# Altium schematic sheet schematic.SchDoc
size A4
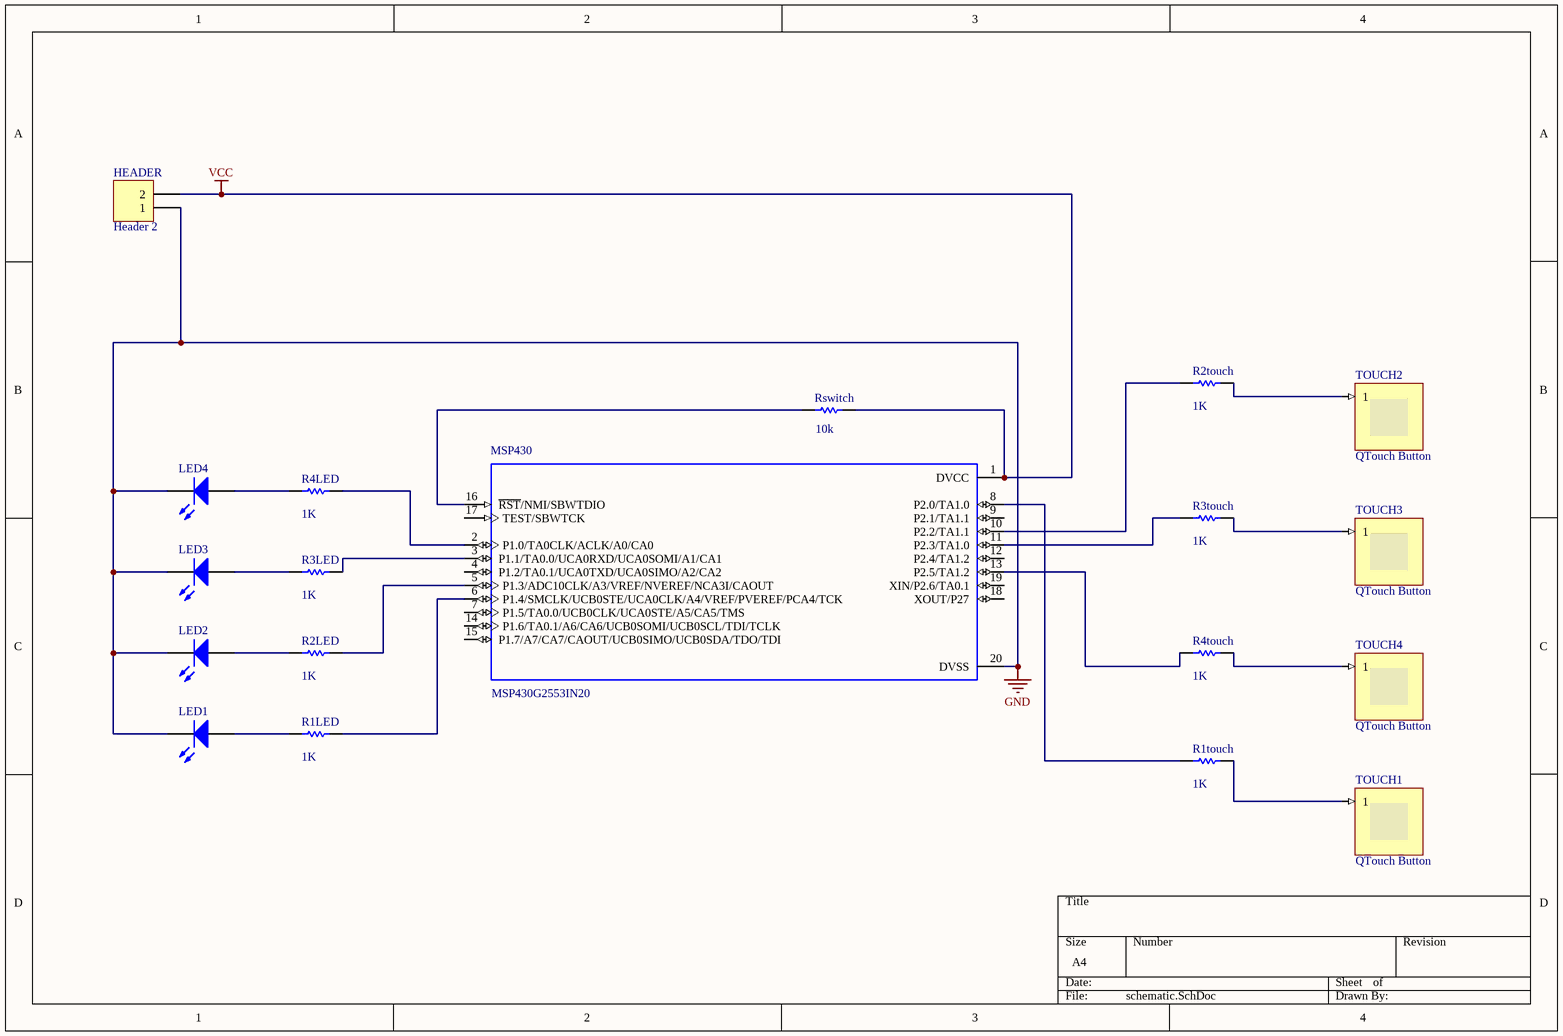
[diagram p0: schematic.SchDoc]

## Parts
HEADER  Header 2  [HDR1X2]
LED1  LED4  [LED-0]  (value not drawn)
LED2  LED3  [LED-0]  (value not drawn)
LED3  LED2  [LED-0]  (value not drawn)
LED4  LED1  [LED-0]  (value not drawn)
MSP430  MSP430G2553IN20  [*DIP794W45P254L2692H508Q20]
R1LED  value 1K  [AXIAL-0.3]  (hidden comment: Res1)
R1touch  value 1K  [AXIAL-0.3]  (hidden comment: Res1)
R2LED  value 1K  [AXIAL-0.3]  (hidden comment: Res1)
R2touch  value 1K  [AXIAL-0.3]  (hidden comment: Res1)
R3LED  value 1K  [AXIAL-0.3]  (hidden comment: Res1)
R3touch  value 1K  [AXIAL-0.3]  (hidden comment: Res1)
R4LED  value 1K  [AXIAL-0.3]  (hidden comment: Res1)
R4touch  value 1K  [AXIAL-0.3]  (hidden comment: Res1)
Rswitch  value 10k  [AXIAL-0.3]  (hidden comment: Rswitch)
TOUCH1  QTouch Button  (no BOM)
TOUCH2  QTouch Button  (no BOM)
TOUCH3  QTouch Button  (no BOM)
TOUCH4  QTouch Button  (no BOM)

## Nets
GND: HEADER.1 LED1.2(K) LED2.2(K) LED3.2(K) LED4.2(K) MSP430.20(DVSS)
VCC: HEADER.2 MSP430.1(DVCC) Rswitch.2
NetLED1_1: LED1.1(A) R1LED.1
NetLED2_1: LED2.1(A) R2LED.1
NetLED3_1: LED3.1(A) R3LED.1
NetLED4_1: LED4.1(A) R4LED.1
NetMSP430_2: MSP430.2(P1.0/TA0CLK/ACLK/A0/CA0) R4LED.2
NetMSP430_3: MSP430.3(P1.1/TA0.0/UCA0RXD/UCA0SOMI/A1/CA1) R3LED.2
NetMSP430_5: MSP430.5(P1.3/ADC10CLK/A3/VREF/NVEREF/NCA3I/CAOUT) R2LED.2
NetMSP430_6: MSP430.6(P1.4/SMCLK/UCB0STE/UCA0CLK/A4/VREF/PVEREF/PCA4/TCK) R1LED.2
NetMSP430_8: MSP430.8(P2.0/TA1.0) R1touch.1
NetMSP430_10: MSP430.10(P2.2/TA1.1) R2touch.1
NetMSP430_11: MSP430.11(P2.3/TA1.0) R3touch.1
NetMSP430_13: MSP430.13(P2.5/TA1.2) R4touch.1
NetMSP430_16: MSP430.16(~{RST}/NMI/SBWTDIO) Rswitch.1
NetR1touch_2: R1touch.2 TOUCH1.1
NetR2touch_2: R2touch.2 TOUCH2.1
NetR3touch_2: R3touch.2 TOUCH3.1
NetR4touch_2: R4touch.2 TOUCH4.1

Not connected (* = marked no-connect by the designer): MSP430 4(P1.2/TA0.1/UCA0TXD/UCA0SIMO/A2/CA2) 7(P1.5/TA0.0/UCB0CLK/UCA0STE/A5/CA5/TMS) 9(P2.1/TA1.1) 12(P2.4/TA1.2) 14(P1.6/TA0.1/A6/CA6/UCB0SOMI/UCB0SCL/TDI/TCLK) 15(P1.7/A7/CA7/CAOUT/UCB0SIMO/UCB0SDA/TDO/TDI) 17(TEST/SBWTCK) 18(XOUT/P27) 19(XIN/P2.6/TA0.1)

## Library data of the parts
HEADER = Header 2: Header, 2-Pin; LatestRevisionDate: 17-Jul-2002; LatestRevisionNote: Re-released for DXP Platform.; Publisher: Altium Limited
LED1-LED4 = LED0: Typical INFRARED GaAs LED; Published: 8-Jun-2000; LatestRevisionDate: 08-Jul-2005; LatestRevisionNote: Mech Layer 1 removed.; PackageReference: LED-0; Publisher: Altium Limited; PackageDescription: LED; 2 Leads
MSP430 = MSP430G2553IN20: MSP430G2x53, MSP430G2x13 Mixed Signal Microcontroller 20-PDIP -40 to 85; MF: Texas Instruments; Price: None; Package: PDIP-20 Texas Instruments; SnapEDA_Link: https://www.snapeda.com/parts/MSP430G2553IN20/Texas%20Instruments/view-part/?ref=snap; Availability: Unavailable; MP: MSP430G2553IN20; Value: *
R1LED R1touch R2LED R2touch R3LED R3touch R4LED R4touch Rswitch = Res1: Resistor; Published: 8-Jun-2000; LatestRevisionDate: 17-Jul-2002; LatestRevisionNote: Re-released for DXP Platform.; PackageReference: AXIAL-0.3; Publisher: Altium Limited; PackageDescription: Axial Device, Thru-Hole; 2 Leads; 0.3 in Pin Spacing
TOUCH1-TOUCH4 = QTouchButton: ConfiguratorName: ATMEL_TOUCH; ConfigurationParameters: {}__sensorid[1]{}width[15]{}height[15]{}